# EAGLE design AFM_QFM_input__smd_xor (EAGLE 9.6.2)
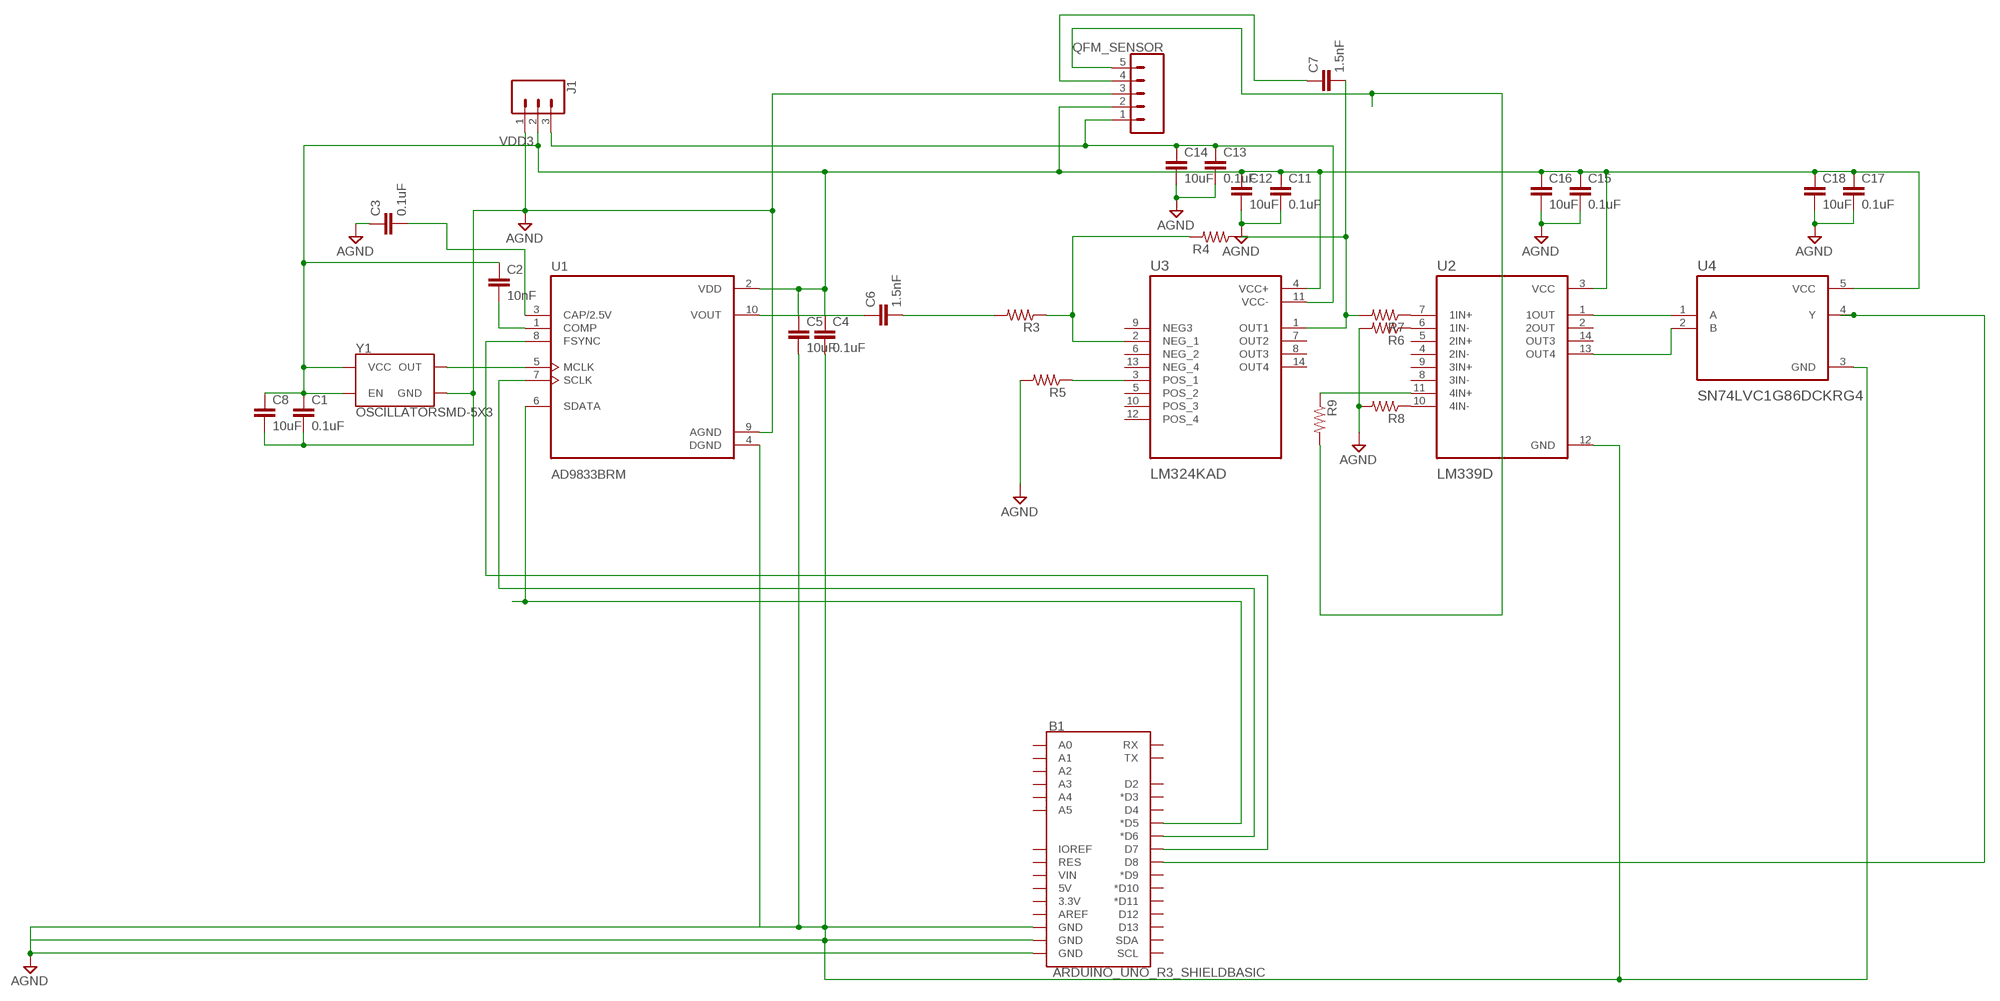
[diagram p0: schematic, sheet 1]

## Parts
B1  ARDUINO_UNO_R3_SHIELDBASIC  [UNO_R3_SHIELD]
C1  0.1uF  0.1UF-0603-100V-10%  [0603]
C2  10nF  10NF-0603-50V-10%  [0603]
C3  0.1uF  0.1UF-0603-100V-10%  [0603]
C4  0.1uF  0.1UF-0603-100V-10%  [0603]
C5  10uF  10UF-0805-10V-10%  [0805]
C6  1.5nF  C-EUC0603  [C0603]
C7  1.5nF  C-EUC0603  [C0603]
C8  10uF  10UF-0805-10V-10%  [0805]
C11  0.1uF  0.1UF-0603-100V-10%  [0603]
C12  10uF  10UF-0805-10V-10%  [0805]
C13  0.1uF  0.1UF-0603-100V-10%  [0603]
C14  10uF  10UF-0805-10V-10%  [0805]
C15  0.1uF  0.1UF-0603-100V-10%  [0603]
C16  10uF  10UF-0805-10V-10%  [0805]
C17  0.1uF  0.1UF-0603-100V-10%  [0603]
C18  10uF  10UF-0805-10V-10%  [0805]
J1  CONN_03LONGPADS  [1X03_LONGPADS]
QFM_SENSOR  CONN_05PTH_LONGPADS  [1X05_LONGPADS]
R3  R-US_R0603  [R0603]
R4  R-US_R0603  [R0603]
R5  R-US_R0603  [R0603]
R6  R-US_R0603  [R0603]
R7  R-US_R0603  [R0603]
R8  R-US_R0603  [R0603]
R9  R-US_R0603  [R0603]
U1  AD9833BRM  [SOP50P490X110-10N]
U2  LM339D  [SOIC127P600X175-14N]
U3  LM324KAD  [SOIC127P600X175-14N]
U4  SN74LVC1G86DCKRG4  [SOT65P210X110-5N]
Y1  OSCILLATORSMD-5X3  [OSCILLATOR-SMD-5X3.2]

## Nets
AGND: B1.GND@0(GND) B1.GND@1(GND) B1.GND@2(GND) C1.2 C3.1 C4.2 C5.2 C8.2 C11.2 C12.2 C13.2 C14.2 C15.2 C16.2 C17.2 C18.2 J1.1 QFM_SENSOR.3 R5.2 R6.2 R8.2 U1.4(DGND) U1.9(AGND) U2.12(GND) U4.3(GND) Y1.2(GND)
N$1: B1.D7 U1.8(FSYNC)
N$2: U1.5(MCLK) Y1.3(OUT)
N$3: B1.D6(*D6) U1.7(SCLK)
N$4: B1.D5(*D5) U1.6(SDATA)
N$5: C2.2 U1.1(COMP)
N$6: C6.1 U1.10(VOUT)
N$7: C3.2 U1.3(CAP/2.5V)
N$8: C6.2 R3.2
N$10: R3.1 R4.2 U3.2(NEG_1)
N$11: C7.1 QFM_SENSOR.4
N$12: C7.2 R4.1 R7.2 U3.1(OUT1)
N$13: R5.1 U3.3(POS_1)
N$14: R6.1 U2.6(1IN-)
N$15: R7.1 U2.7(1IN+)
N$16: U2.1(1OUT) U4.1(A)
N$17: R8.1 U2.10(4IN-)
N$18: R9.1 U2.11(4IN+)
N$19: QFM_SENSOR.5 R9.2
N$21: U2.13(OUT4) U4.2(B)
N$22: B1.D8 U4.4(Y)
VCC: C13.1 C14.1 J1.3 QFM_SENSOR.1 U3.11(VCC-)
VDD3: C1.1 C2.1 C4.1 C5.1 C8.1 C11.1 C12.1 C15.1 C16.1 C17.1 C18.1 J1.2 QFM_SENSOR.2 U1.2(VDD) U2.3(VCC) U3.4(VCC+) U4.5(VCC) Y1.1(EN) Y1.4(VCC)
Unconnected: B1.3.3V B1.5V B1.A0 B1.A1 B1.A2 B1.A3 B1.A4 B1.A5 B1.AREF B1.D2 B1.D3(*D3) B1.D4 B1.D9(*D9) B1.D10(*D10) B1.D11(*D11) B1.D12 B1.D13 B1.IOREF B1.RES B1.RX B1.SCL B1.SDA B1.TX B1.VIN U2.2(2OUT) U2.4(2IN-) U2.5(2IN+) U2.8(3IN-) U2.9(3IN+) U2.14(OUT3) U3.5(POS_2) U3.6(NEG_2) U3.7(OUT2) U3.8(OUT3) U3.9(NEG3) U3.10(POS_3) U3.12(POS_4) U3.13(NEG_4) U3.14(OUT4)

## Library data of the parts
B1 = SparkFun-Boards:ARDUINO_UNO_R3_SHIELD: Arduino R3 Shield Footprint Shield form compatible with the Arduino Uno R3. SparkFun Products: MG2639 Cellular Shield <https://www.sparkfun.com/products/13120> MIDI Shield <https://www.sparkfun.com/products/12898> R3 Stackable Headers Kit <https://www.sparkfun.com/products/11417>
C1 C3 C4 C11 C13 C15 C17 = SparkFun-Capacitors:0.1UF: 0.1µF ceramic capacitors A capacitor is a passive two-terminal electrical component used to store electrical energy temporarily in an electric field.; PROD_ID: CAP-08390
C2 = SparkFun-Capacitors:10NF: 0.01uF/10nF/10,000pF ceramic capacitors A capacitor is a passive two-terminal electrical component used to store electrical energy temporarily in an electric field. CAP-09321; PROD_ID: CAP-00867
C5 C8 C12 C14 C16 C18 = SparkFun-Capacitors:10UF: 10.0µF ceramic capacitors A capacitor is a passive two-terminal electrical component used to store electrical energy temporarily in an electric field.; PROD_ID: CAP-11330
C6 C7 = resistor:C-EU: CAPACITOR, European symbol
J1 = SparkFun-Connectors:CONN_03: Multi connection point. Often used as Generic Header-pin footprint for 0.1 inch spaced/style header connections On any of the 0.1 inch spaced packages, you can populate with these: Break Away Headers - Straight <https://www.sparkfun.com/products/116> (PRT-00116) Break Away Male Headers - Right Angle <https://www.sparkfun.com/products/553> (PRT-00553) Female Headers <https://www.sparkfun.com/products/115> (PRT-00115) Break Away Headers - Machine Pin <https://www.sparkfun.com/products/117> (PRT-00117) Break Away Female Headers - Swiss Machine Pin <https://www.sparkfun.com/products/743> (PRT-00743) Stackable Header - 3 Pin (Female, 0.1") <https://www.sparkfun.com/products/13875> (PRT-13875) For SCREWTERMINALS and SPRING TERMINALS visit here: Screw Terimnals on SparkFun.com <https://www.sparkfun.com/search/results?term=Screw+Terminals> (5mm/3.5mm/2.54mm spacing) This device is also useful as a general connection point to wire up your design to another part of your project. Our various solder wires solder well into these plated through hole pads. Hook-Up Wire - Assortment (Stranded, 22 AWG) <https://www.sparkfun.com/products/11375> (PRT-11375) Hook-Up Wire - Assortment (Solid Core, 22 AWG) <https://www.sparkfun.com/products/11367> (PRT-11367) View the entire wire category on our website here <https://www.sparkfun.com/categories/141> Special notes: Molex polarized connector foot print use with SKU : PRT-08232 with associated crimp pins and housings.
QFM_SENSOR = SparkFun-Connectors:CONN_05: Multi connection point. Often used as Generic Header-pin footprint for 0.1 inch spaced/style header connections On any of the 0.1 inch spaced packages, you can populate with these: Break Away Headers - Straight <https://www.sparkfun.com/products/116> (PRT-00116) Break Away Male Headers - Right Angle <https://www.sparkfun.com/products/553> (PRT-00553) Female Headers <https://www.sparkfun.com/products/115> (PRT-00115) Break Away Headers - Machine Pin <https://www.sparkfun.com/products/117> (PRT-00117) Break Away Female Headers - Swiss Machine Pin <https://www.sparkfun.com/products/743> (PRT-00743) For SCREWTERMINALS and SPRING TERMINALS visit here: Screw Terimnals on SparkFun.com <https://www.sparkfun.com/search/results?term=Screw+Terminals> (5mm/3.5mm/2.54mm spacing) This device is also useful as a general connection point to wire up your design to another part of your project. Our various solder wires solder well into these plated through hole pads. Hook-Up Wire - Assortment (Stranded, 22 AWG) <https://www.sparkfun.com/products/11375> (PRT-11375) Hook-Up Wire - Assortment (Solid Core, 22 AWG) <https://www.sparkfun.com/products/11367> (PRT-11367) View the entire wire category on our website here <https://www.sparkfun.com/categories/141> Special notes: Molex polarized connector foot print use with SKU : PRT-08231 with associated crimp pins and housings. 1MM SMD Version SKU: PRT-10208
R3-R9 = rcl:R-US_: RESISTOR, American symbol; SPICEPREFIX: R
U1 = AD9833BRM:AD9833BRM: Direct Digital Synthesizer 25MHz 1-DAC 10-Bit Serial 10-Pin MSOP Tube Check availability <https://pricing.snapeda.com/parts/AD9833BRM/Analog%20Devices/view-part?ref=eda>; AVAILABILITY: In Stock; CHECK_PRICES: https://www.snapeda.com/parts/AD9833BRM/Analog+Devices/view-part/?ref=eda; DESCRIPTION: Direct Digital Synthesis IC 10 b 25 MHz 28 b Tuning 10-MSOP; MF: Analog Devices; MP: AD9833BRM; PACKAGE: MSOP-10 Analog Devices; PRICE: None; PURCHASE-URL: https://www.snapeda.com/api/url_track_click_mouser/?unipart_id=107089&manufacturer=Analog Devices&part_name=AD9833BRM&search_term=ad9833; SNAPEDA_LINK: https://www.snapeda.com/parts/AD9833BRM/Analog+Devices/view-part/?ref=snap
U2 = LM339D:LM339D: Check availability <https://pricing.snapeda.com/parts/LM339D/Texas%20Instruments/view-part?ref=eda>; AVAILABILITY: In Stock; CHECK_PRICES: https://www.snapeda.com/parts/LM339D/Texas+Instruments/view-part/?ref=eda; DESCRIPTION: Quad differential comparator; MF: Texas Instruments; MP: LM339D; PACKAGE: SOIC-14 Texas Instruments; PRICE: None; PURCHASE-URL: https://www.snapeda.com/api/url_track_click_mouser/?unipart_id=4792513&manufacturer=Texas Instruments&part_name=LM339D&search_term=lm339; SNAPEDA_LINK: https://www.snapeda.com/parts/LM339D/Texas+Instruments/view-part/?ref=snap
U3 = LM324KAD:LM324KAD: Check availability <https://pricing.snapeda.com/parts/LM324KAD/Texas%20Instruments/view-part?ref=eda>; AVAILABILITY: In Stock; CHECK_PRICES: https://www.snapeda.com/parts/LM324KAD/Texas+Instruments/view-part/?ref=eda; DESCRIPTION: Quad, 30-V, 1.2-MHz, 3-mV offset voltage, improved ESD (2kV) operational amplifier; MF: Texas Instruments; MP: LM324KAD; PACKAGE: SOIC-14 Texas Instruments; PRICE: None; PURCHASE-URL: https://www.snapeda.com/api/url_track_click_mouser/?unipart_id=497506&manufacturer=Texas Instruments&part_name=LM324KAD&search_term=lm324; SNAPEDA_LINK: https://www.snapeda.com/parts/LM324KAD/Texas+Instruments/view-part/?ref=snap
U4 = SN74LVC1G86DCKRG4:SN74LVC1G86DCKRG4: Check availability <https://pricing.snapeda.com/parts/SN74LVC1G86DCKRG4/Texas%20Instruments/view-part?ref=eda>; AVAILABILITY: In Stock; CHECK_PRICES: https://www.snapeda.com/parts/SN74LVC1G86DCKRG4/Texas+Instruments/view-part/?ref=eda; DESCRIPTION: Single 2-input, 1.65-V to 5.5-V XOR (exclusive OR) gate; MF: Texas Instruments; MP: SN74LVC1G86DCKRG4; PACKAGE: SC70-5 Texas Instruments; PRICE: None; SNAPEDA_LINK: https://www.snapeda.com/parts/SN74LVC1G86DCKRG4/Texas+Instruments/view-part/?ref=snap
Y1 = SparkFun-Clocks:OSCILLATOR: Oscillators (Generic) These are active oscillators, which require a power source to generate their clock output. Most oscillators are configured to generate a set frequency (e.g. 16MHz). They have four pins: power, ground, output, and an enable input.

## Board
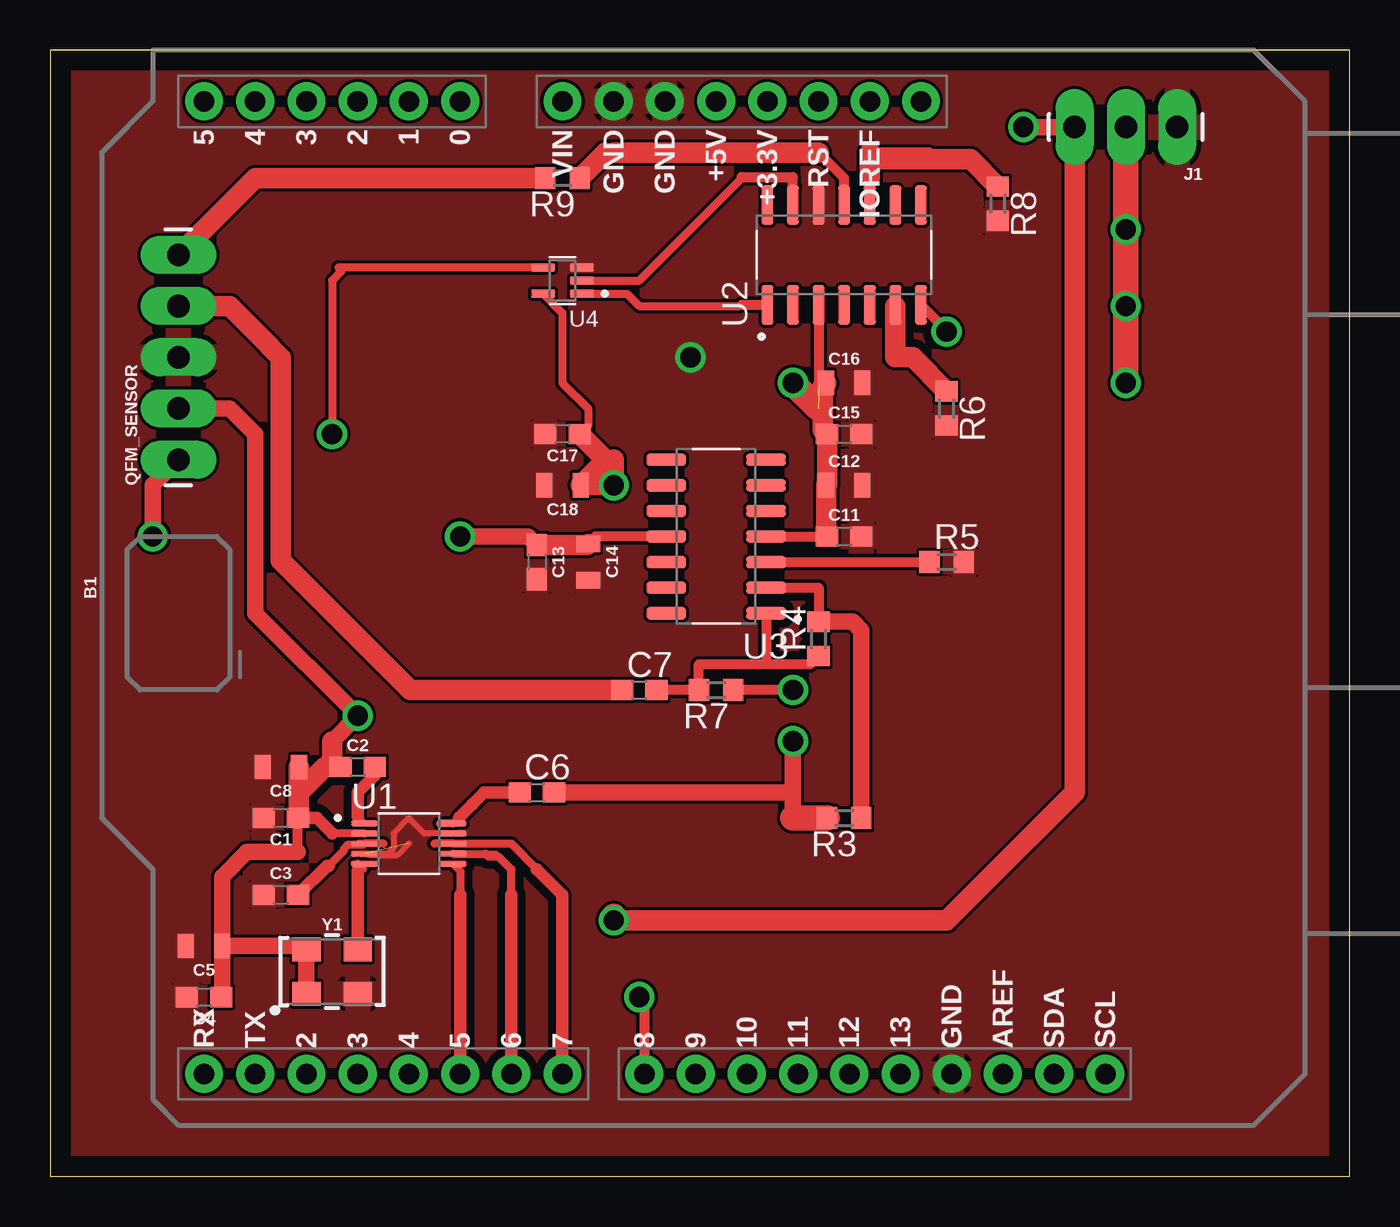
[diagram p1: board, top side]
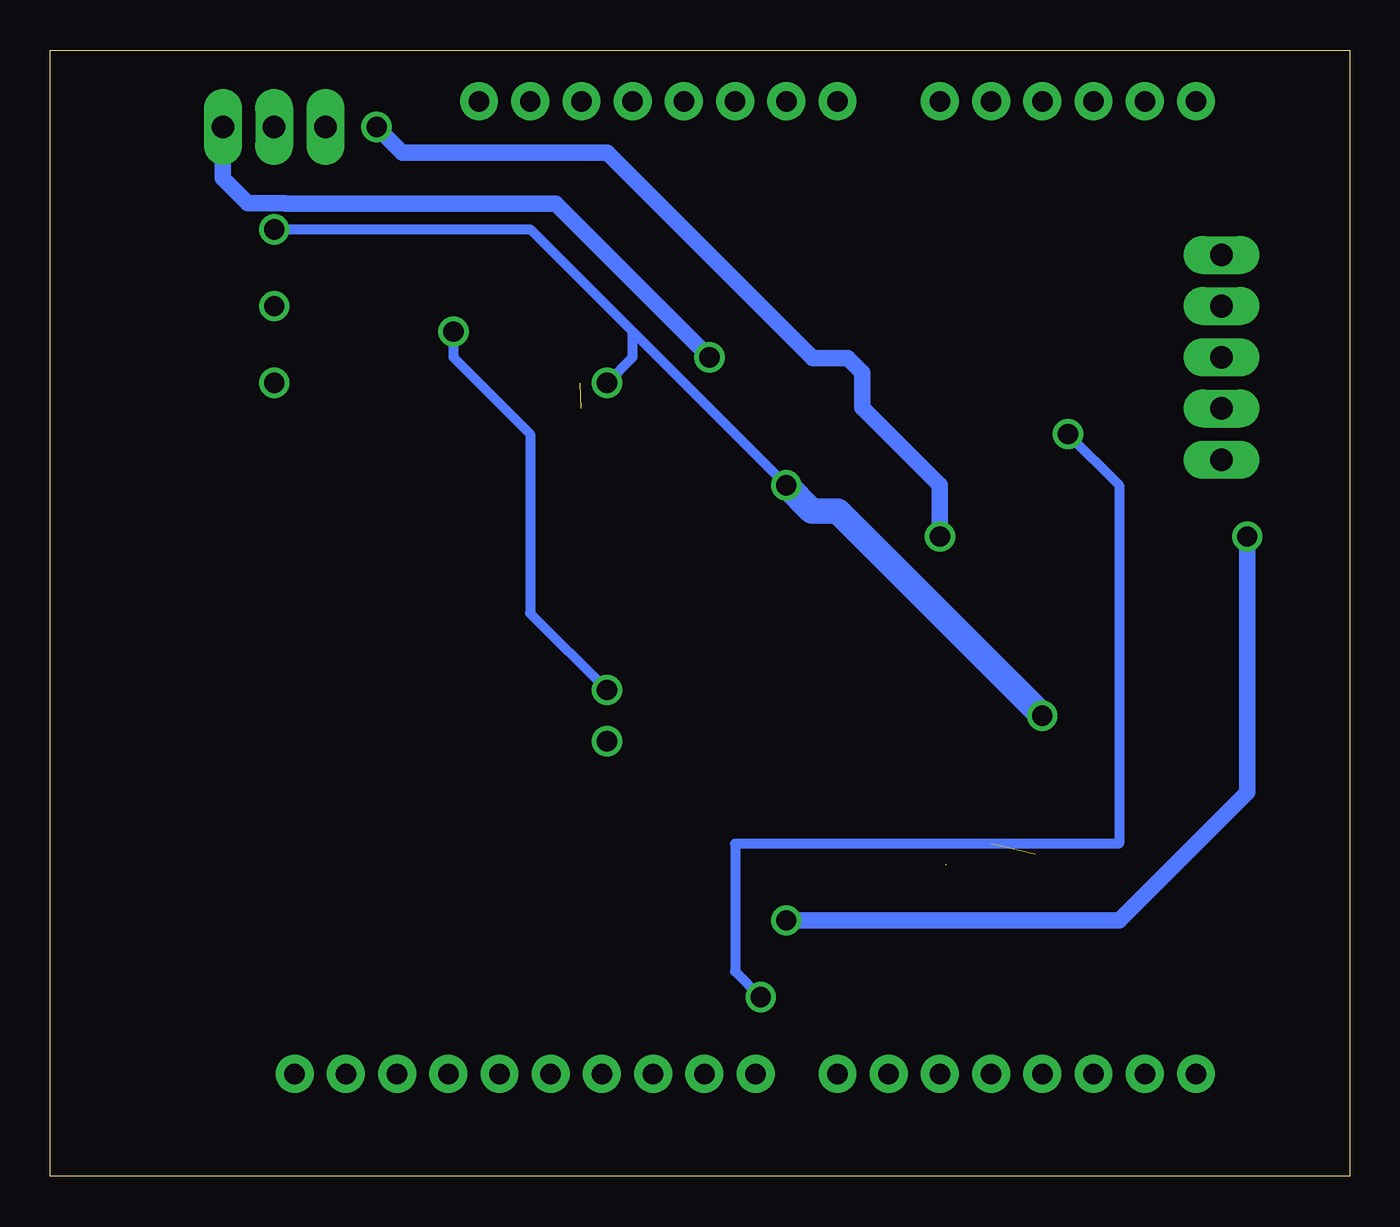
[diagram p2: board, bottom side, seen from below]

Size 64.44 x 55.87 mm. Coordinates in mm from the lower left corner, seen from the top.
Outline: 0,0 64.44,0 64.44,55.87 0,55.87 0,0
Copper layers (1*16): Top 0.035mm / dielectric 1.5mm / Bottom 0.035mm
Design rules "default": minimum track width 6mil, minimum drill 0.35mm, track to track 6mil, track to pad 6mil, pad to pad 6mil, via to via 6mil, smd to smd 6mil, copper to edge 40mil, drill to drill 6mil, minimum pad ring 10mil, minimum via ring 8mil, stop-mask expansion 4mil, vias tented up to drill 0mil, thermal gap 10mil

### Footprints (pad centres in the part's own frame; a part is rotated, then mirrored left to right if it is on the bottom)
UNO_R3_SHIELD = drill 1.016 pad 1.88: 3.3V 24.13,-2.54; 5V 24.13,0; A0 24.13,12.7; A1 24.13,15.24; A2 24.13,17.78; A3 24.13,20.32; A4 24.13,22.86; A5 24.13,25.4; AREF -24.13,-14.224; D2 -24.13,20.32; D3 -24.13,17.78; D4 -24.13,15.24; D5 -24.13,12.7; D6 -24.13,10.16; D7 -24.13,7.62; D8 -24.13,3.556; D9 -24.13,1.016; D10 -24.13,-1.524; D11 -24.13,-4.064; D12 -24.13,-6.604; D13 -24.13,-9.144; GND@0 24.13,2.54; GND@1 24.13,5.08; GND@2 -24.13,-11.684; IOREF 24.13,-7.62; NC 24.13,-10.16; RES 24.13,-5.08; RX -24.13,25.4; SCL -24.13,-19.304; SDA -24.13,-16.764; TX -24.13,22.86; VIN 24.13,7.62
0603 = smd 1.1 x 1: 1 -0.85,0; 2 0.85,0
0805 = smd 0.8 x 1.2: 1 -0.9,0; 2 0.9,0
C0603 = smd 1.1 x 1: 1 -0.85,0; 2 0.85,0
1X03_LONGPADS = drill 1.118 pad 1.88 long: 1 0,0; 2 2.54,0; 3 5.08,0
1X05_LONGPADS = drill 1.118 pad 1.88 long: 1 0,0; 2 2.54,0; 3 5.08,0; 4 7.62,0; 5 10.16,0
R0603 = smd 1 x 1.1: 1 -0.85,0; 2 0.85,0
SOP50P490X110-10N = smd 1.32 x 0.28: 1 -2.2,1; 2 -2.2,0.5; 3 -2.2,0; 4 -2.2,-0.5; 5 -2.2,-1; 6 2.2,-1; 7 2.2,-0.5; 8 2.2,0; 9 2.2,0.5; 10 2.2,1
SOIC127P600X175-14N = smd 1.97 x 0.6: 1 -2.475,3.81; 2 -2.475,2.54; 3 -2.475,1.27; 4 -2.475,0; 5 -2.475,-1.27; 6 -2.475,-2.54; 7 -2.475,-3.81; 8 2.475,-3.81; 9 2.475,-2.54; 10 2.475,-1.27; 11 2.475,0; 12 2.475,1.27; 13 2.475,2.54; 14 2.475,3.81
SOT65P210X110-5N = smd 1.19 x 0.4: 1 -0.96,0.65; 2 -0.96,0; 3 -0.96,-0.65; 4 0.96,-0.65; 5 0.96,0.65
OSCILLATOR-SMD-5X3.2 = smd 1.397 x 1.194: 1 -1.27,-1.1; 2 1.27,-1.1; 3 1.27,1.1; 4 -1.27,1.1

### Placement (x,y rotation side)
B1  33.02,29.21 90 top
C1  11.43,17.78 180 top
C2  15.24,20.32 0 top
C3  11.43,13.97 0 top
C4  7.62,8.89 180 top
C5  7.62,11.43 180 top
C6  24.13,19.05 0 top
C7  29.21,24.13 0 top
C8  11.43,20.32 180 top
C11  39.37,31.75 0 top
C12  39.37,34.29 0 top
C13  24.13,30.48 270 top
C14  26.67,30.48 270 top
C15  39.37,36.83 0 top
C16  39.37,39.37 0 top
C17  25.4,36.83 180 top
C18  25.4,34.29 180 top
J1  55.88,52.07 180 top
QFM_SENSOR  6.35,35.56 90 top
R3  39.37,17.78 180 top
R4  38.1,26.67 90 top
R5  44.45,30.48 0 top
R6  44.45,38.1 270 top
R7  33.02,24.13 180 top
R8  46.99,48.26 270 top
R9  25.4,49.53 180 top
U1  17.78,16.51 0 top
U2  39.37,45.72 90 top
U3  33.02,31.75 180 top
U4  25.4,44.45 180 top
Y1  13.97,10.16 0 top

### Tracks (layer width: path | path; a pad name or v marks a point on that pad's centre or on a via)
AGND  (via drill 1)  (1 unrouted)
  Top 0.305: U1.9 18.55,17.01 17.78,17.78 17.02,17.02 17.02,16.3 16.72,16 15.79,16 15.76,15.97 15.77,15.97 15.78,15.96 17.23,15.96 17.78,16.51
  Bottom 0.813: v31.75,40.64 39.37,48.26 52.76,48.26 52.8,48.3 54.65,48.3 55.88,49.53 J1.1
  pour Top (isolate 0.406, rank 6): 0,55.88 64.77,55.88 64.77,0 0,0
  pour Top: 63.5,55.88 63.5,0 -1.27,0 -1.27,55.88
  pour Top: 64.77,55.88 64.77,0 -1.27,0 -1.27,55.88
  pour Top (isolate 0.254): 64.77,55.88 64.77,0 -1.27,0 -1.27,55.88
  pour Top (isolate 0.406): 64.77,55.88 64.77,0 -1.27,0 -1.27,55.88
N$1
  Top 0.406: 24.13,15.24 22.86,16.51 U1.8 19.05,16.51
  Top 0.61: B1.D7 25.4,13.97 24.13,15.24
N$2
  Top 0.305: 15.07,15.51 15.24,15.51 U1.5 15.24,15.17 | 15.24,11.43 Y1.3
  Top 0.406: 15.51,15.24 15.24,15.51
  Top 0.61: 15.24,15.17 15.24,11.43
N$3
  Top 0.305: 21.59,16.01 22.09,16.01 22.22,15.88
  Top 0.406: U1.7 21.59,16.01 21.72,15.88 22.22,15.88 22.86,15.24 22.86,13.97
  Top 0.61: B1.D6 22.86,13.97
N$4  (1 unrouted)
  Top 0.305: 20.29,15.21 20.32,15.17
  Top 0.406: 20.04,15.45 20.25,15.24 20.32,15.17 20.32,13.97
  Top 0.61: B1.D5 20.32,13.97
N$5
  Top 0.305: 15.24,17.85 U1.1
  Top 0.61: C2.2 16.09,19.9 15.24,19.05 15.24,17.85
N$6
  Top 0.305: 20.29,17.82 U1.10
  Top 0.406: 19.32,17.51 U1.10 20.92,18.45
  Top 0.61: C6.1 21.52,19.05 20.92,18.45 20.29,17.82
N$7
  Top 0.152: 13.72,15.41 14.76,16.45 14.83,16.45
  Top 0.305: 14.83,16.45 13.79,15.41
  Top 0.406: 16.51,16.51 U1.3 | U1.3 15.53,16.45 15.24,16.45 | 15.24,16.45 14.83,16.45 | 15.24,16.45 15.29,16.51 U1.3 | 13.79,15.41 14.56,16.18 14.56,16.26 14.76,16.45
  Top 0.61: C3.2 13.72,15.41 13.79,15.41
N$8  (via drill 1)
  Top 0.813: v36.83,21.59 36.83,19.05 | 36.83,19.05 36.83,17.78 | C6.2 36.83,19.05
  Top 1.27: 36.83,17.78 R3.2
N$10
  Top 0.508: U3.2 38.1,29.21 R4.2
  Top 0.813: R3.1 40.22,27.09 39.79,27.52 R4.2
N$11
  Top 0.508: 11.43,30.55 11.43,40.64 8.89,43.18
  Top 1.016: QFM_SENSOR.4 8.89,43.18 10.89,41.18 10.89,41.16 11.43,40.62 11.43,30.55 17.84,24.13 C7.1
N$12
  Top 0.508: U3.1 35.5,25.4 | R4.1 37.68,25.4 35.5,25.4 | 35.5,25.4 32.17,25.4 R7.2 C7.2
N$13
  Top 0.508: U3.3 R5.1
N$14
  Top 0.508: 41.91,43.18 U2.6
  Top 1.016: R6.1 42.76,40.64 41.91,40.64 41.91,43.18
N$15  (via drill 1)
  Top 0.508: v36.83,24.13 R7.1 | U2.7 44.45,41.98 v44.45,41.91
  Bottom 0.508: v36.83,24.13 40.64,27.94 40.64,36.83 44.45,40.64 v44.45,41.91
N$16
  Top 0.406: U4.1 28.59,43.8 29.21,43.18 34.23,43.18 34.29,43.24
  Top 0.508: 34.29,43.24 U2.1
N$17
  Top 0.508: U2.10 40.64,49.53 40.64,50.8 43.6,50.8 44.28,50.46
  Top 1.016: R8.1 45.64,50.46 44.28,50.46 40.98,50.46 | 40.98,50.46 40.64,50.8 | 40.98,50.46 40.64,50.12 40.64,49.53
N$18
  Top 0.508: U2.11 39.37,49.53 38.1,50.8 | 27.52,50.8 27.94,50.8
  Top 1.016: R9.1 27.52,50.8 | 27.94,50.8 38.1,50.8
N$19
  Top 0.508: 24.13,49.53 R9.2
  Top 1.016: QFM_SENSOR.5 10.16,49.53 24.13,49.53
N$21
  Top 0.406: U4.2 29.21,44.45 34.29,49.53 34.29,49.59
  Top 0.508: U2.13 36.83,49.59 34.29,49.59
N$22  (via drill 1)
  Top 0.406: U4.4 14.28,45.1 14.45,44.93 13.97,44.45 v13.97,36.83
  Top 0.508: v29.21,8.89 29.46,8.64 B1.D8
  Bottom 0.508: v13.97,36.83 11.43,34.29 11.43,16.51 30.48,16.51 30.48,10.16 v29.21,8.89
VCC  (via drill 1)
  Top 0.508: U3.11 27.04,31.75 C14.1
  Top 0.813: QFM_SENSOR.1 5.08,34.29 v5.08,31.75 | J1.3 v48.26,52.07 | C13.1 23.71,31.75 v20.32,31.75
  Top 1.016: J1.3 50.8,19.05 44.45,12.7 v27.94,12.7 | C14.1 26.62,31.33 C13.1
  Top 1.27: v27.94,12.7 27.94,12.9
  Bottom 0.813: v27.94,12.7 11.43,12.7 5.08,19.05 v5.08,31.75 | v20.32,31.75 20.32,34.29 24.17,38.14 24.17,39.88 24.89,40.6 26.63,40.6 36.83,50.8 46.99,50.8 v48.26,52.07
VDD3  (via drill 1)  (1 unrouted)
  Top 0.305: 12.33,17.83 C1.1 | C8.1 12.51,20.14 12.51,19.23 | 13.6,20.32 13.97,20.32 C2.1 | 12.62,11.35 Y1.4 8.59,11.26 8.47,11.38 | C4.1 8.47,11.38 | 8.47,11.38 C5.1
  Top 0.406: U1.2 13.97,17.01 | U4.5 25.4,42.84 25.4,39.37 26.67,38.1 26.67,37.25 C17.1
  Top 0.508: 12.28,16.09 C1.1 | U3.4 C11.1 38.47,31.8 | C16.1 38.17,39.37 | C15.1 38.31,37.04 38.1,37.25 U2.3
  Top 0.61: C1.1 13.2,17.78 13.97,17.01
  Top 0.813: C5.1 12.53,11.43 12.62,11.35 | Y1.4 Y1.1 | C5.1 8.52,8.94 C4.1 | 13.97,21.59 v15.24,22.86 10.16,27.94 10.16,36.83 8.89,38.1 QFM_SENSOR.2 | C5.1 8.52,14.87 9.74,16.09 12.28,16.09
  Top 1.016: 13.97,20.32 13.97,21.59 | 13.6,20.32 12.51,19.23 | C8.1 12.33,17.83 | C17.1 27.54,35.53 C18.1 v27.94,34.29 27.94,35.56 | C15.1 38.52,34.34 C12.1 38.47,31.8 | C16.1 38.31,39.21 38.31,37.04
  Top 1.27: J1.2 v53.34,46.99 v53.34,43.18 v53.34,39.37 | v36.83,39.37 38.1,38.1
  Bottom 0.508: v53.34,46.99 40.64,46.99 35.56,41.91 | 35.56,41.91 v27.94,34.29 | v36.83,39.37 35.56,40.64 35.56,41.91
  Bottom 1.27: v27.94,34.29 26.67,33.02 25.4,33.02 v15.24,22.86